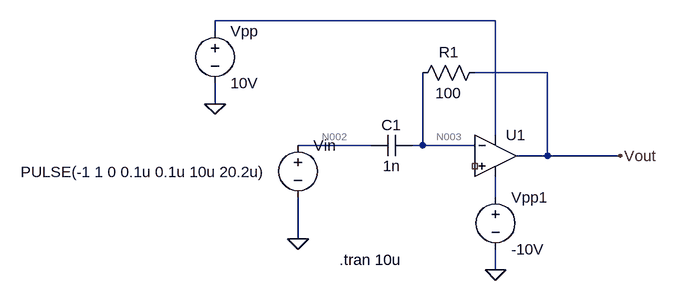
[diagram p0: schematic Differentiator_op_amp.asc]
Differentiator_op_amp.asc, the LTspice schematic file:
Version 4
SHEET 1 880 680
WIRE 256 -32 -176 -32
WIRE -176 -16 -176 -32
WIRE 336 48 224 48
WIRE -176 96 -176 64
WIRE 256 144 256 -32
WIRE 64 160 -48 160
WIRE 144 160 144 48
WIRE 144 160 128 160
WIRE 224 160 144 160
WIRE 336 176 336 48
WIRE 336 176 288 176
WIRE 448 176 336 176
WIRE 256 240 256 208
WIRE -48 304 -48 240
WIRE 256 352 256 320
FLAG -176 96 0
FLAG -48 304 0
FLAG 256 352 0
FLAG 448 176 Vout
SYMBOL Opamps\\UniversalOpamp2 256 176 R0
SYMATTR InstName U1
SYMBOL voltage -48 144 R0
WINDOW 123 0 0 Left 0
WINDOW 39 0 0 Left 0
WINDOW 3 -427 57 Left 2
SYMATTR InstName Vin
SYMATTR Value PULSE(-1 1 0 0.1u 0.1u 10u 20.2u)
SYMBOL cap 128 144 R90
WINDOW 0 0 32 VBottom 2
WINDOW 3 32 32 VTop 2
SYMATTR InstName C1
SYMATTR Value 1n
SYMBOL res 240 32 R90
WINDOW 0 0 56 VBottom 2
WINDOW 3 32 56 VTop 2
SYMATTR InstName R1
SYMATTR Value 100
SYMBOL voltage -176 -32 R0
WINDOW 123 0 0 Left 0
WINDOW 39 0 0 Left 0
SYMATTR InstName Vpp
SYMATTR Value 10V
SYMBOL voltage 256 224 R0
WINDOW 123 0 0 Left 0
WINDOW 39 0 0 Left 0
SYMATTR InstName Vpp1
SYMATTR Value -10V
TEXT 16 336 Left 2 !.tran 10u

The netlist it stands for:
* Differentiator_op_amp.asc
XU1 NC_01 N003 N001 N004 Vout level.2 Avol=1Meg GBW=10Meg Slew=10Meg ilimit=25m rail=0 Vos=0 phimargin=45 en=0 enk=0 in=0 ink=0 Rin=500Meg  ; pins IN+ IN- V+ V- OUT
Vin N002 0 PULSE(-1 1 0 0.1u 0.1u 10u 20.2u)
C1 N003 N002 1n
R1 Vout N003 100
Vpp N001 0 10V
Vpp1 N004 0 -10V
.tran 10u
.lib UniversalOpamps2.sub
.backanno
.end

* Results of the author's LTspice run, read from the files saved beside the schematic
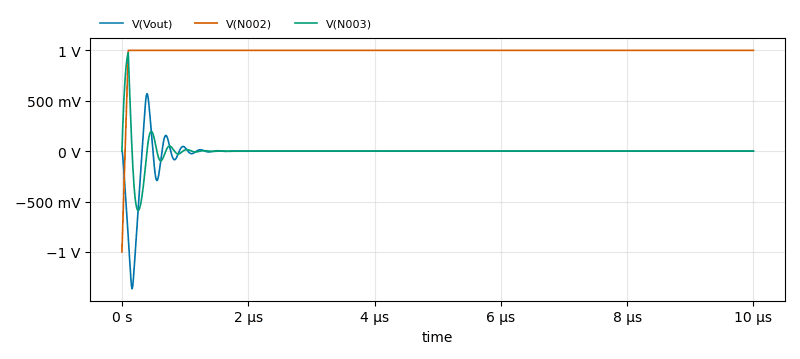
[diagram p1: Transient Analysis of Differentiator_op_amp.asc, plotted from the saved traces]
* Transient Analysis, 1 run:
*   V(Vout): min -1.366 V, max 570.7 mV, average -18.44 mV, rms 157.5 mV, last 0 V
*   V(N002): min -1 V, max 1 V, average 990 mV, rms 996.7 mV, last 1 V
*   V(N003): min -588 mV, max 976 mV, average 1.55 mV, rms 106.5 mV, last 0 V